# Altium schematic sheet MyCTRL_V2_Base_2.SchDoc
size A4; SheetNumber: 2; SheetTotal: 6
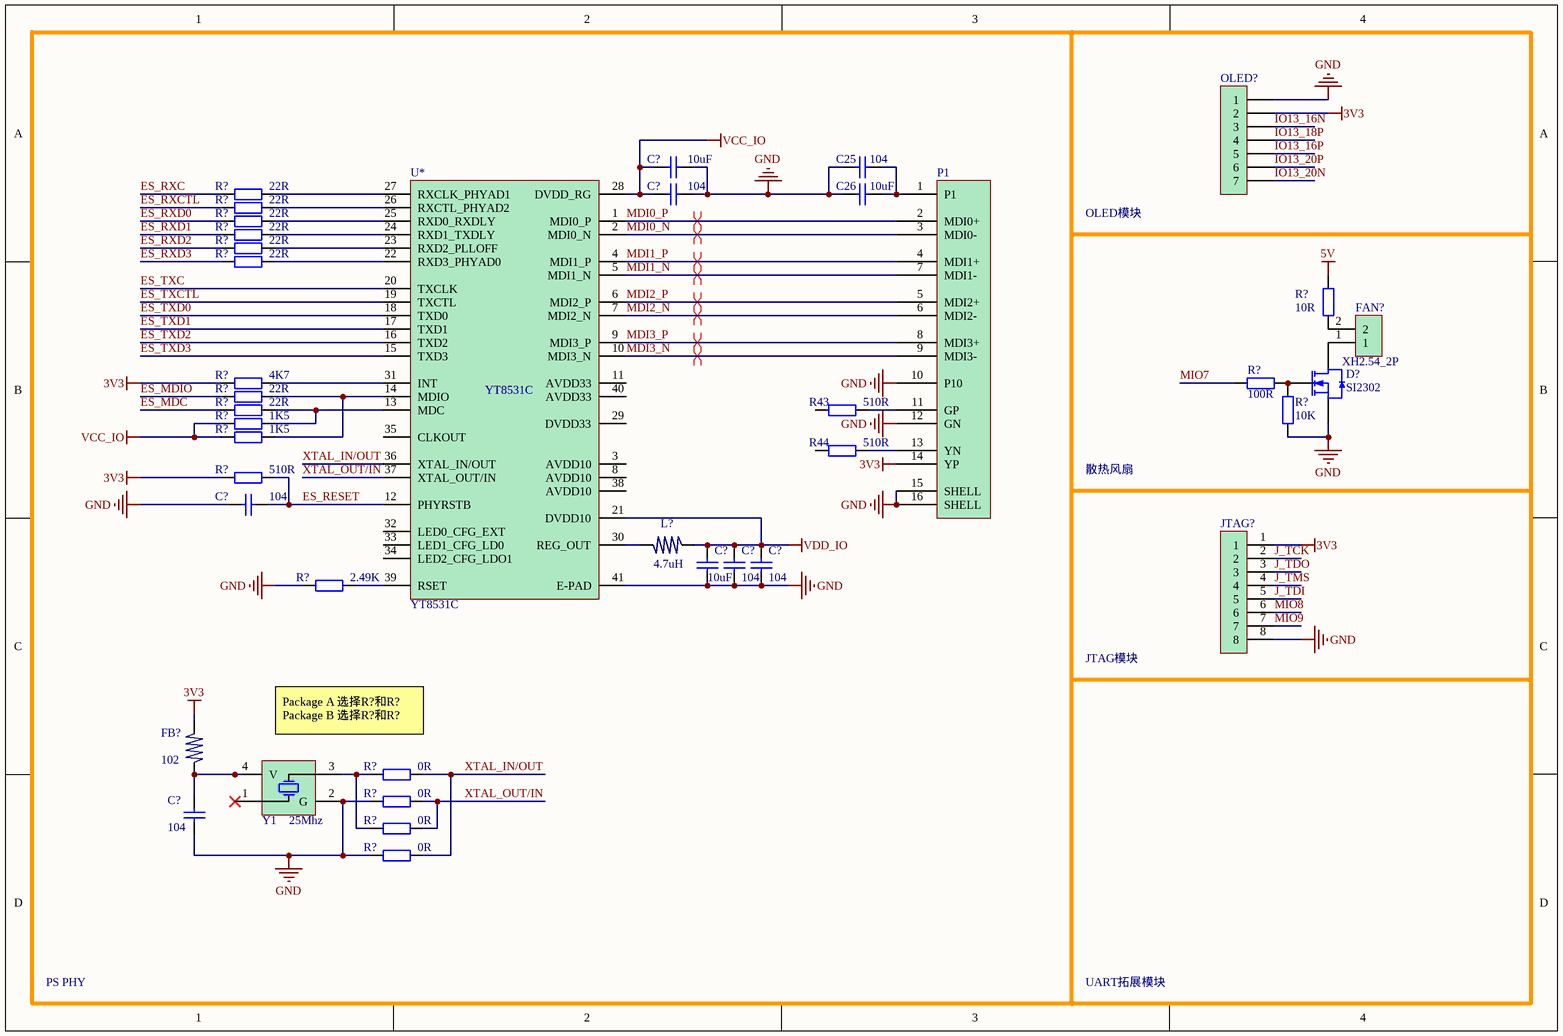
[diagram p0: MyCTRL_V2_Base_2.SchDoc]

## Parts
(Parts that share a designator on the sheet are numbered #1, #2 ... from top to bottom, then left to right.)
C25  104  [0402]
C26  10uF  [0402]
C?#1  10uF  [0402]
C?#2  104  [0402]
C?#3  104  [0402]
C?#4  10uF  [0402]
C?#5  104  [0402]
C?#6  104  [0402]
C?#7  104  [0402]
D?  SI2302  [SOT23]
FAN?  XH2.54_2P  [XH2.5_2P]
FB?  102  [0603]
JTAG?  SH1.25mm_8P  [SH1.25MM_8P]  (value not drawn)
L?  4.7uH  [0805]
OLED?  Header_2.54_7P  [HDR1_7P]  (value not drawn)
P1  RJ45  [HR911130A]  (value not drawn)
R43  510R  [R_0402]
R44  510R  [R_0402]
R?#1  22R  [R_0402]
R?#2  22R  [R_0402]
R?#3  22R  [R_0402]
R?#4  22R  [R_0402]
R?#5  22R  [R_0402]
R?#6  22R  [R_0402]
R?#7  10R  [R_0402]
R?#8  4K7  [R_0402]
R?#9  100R  [R_0402]
R?#10  10K  [R_0402]
R?#11  22R  [R_0402]
R?#12  22R  [R_0402]
R?#13  1K5  [R_0402]
R?#14  1K5  [R_0402]
R?#15  510R  [R_0402]
R?#16  2.49K  [R_0402]
R?#17  0R  [R_0402]
R?#18  0R  [R_0402]
R?#19  0R  [R_0402]
R?#20  0R  [R_0402]
U*  YT8531C
Y1  25Mhz  [XTAL_3225]

## Nets
3V3: FB?.1 JTAG?.1 OLED?.2 P1.14(YP) R?#8.1 R?#15.1
5V: R?#7.1
GND: C25.1 C26.1 C?#1.1 C?#2.2 C?#3.2 C?#4.1 C?#5.1 C?#6.1 C?#7.1 D?.2(S) JTAG?.8 OLED?.1 P1.10(P10) P1.12(GN) P1.15(SHELL) P1.16(SHELL) R?#10.2 R?#16.1 R?#18.1 R?#20.1 U*.41(E-PAD) Y1.2(G)
VCC_IO: C?#1.2 C?#2.1 R?#13.1 R?#14.1 U*.28(DVDD_RG)
VDD_IO: C?#4.2 C?#5.2 C?#6.2 L?.1 U*.21(DVDD10)
ES_MDC: R?#12.1
ES_MDIO: R?#11.1
ES_RESET: C?#3.1 R?#15.2 U*.12(PHYRSTB)
ES_RXC: R?#1.1
ES_RXCTL: R?#2.1
ES_RXD0: R?#3.1
ES_RXD1: R?#4.1
ES_RXD2: R?#5.1
ES_RXD3: R?#6.1
ES_TXC: U*.20(TXCLK)
ES_TXCTL: U*.19(TXCTL)
ES_TXD0: U*.18(TXD0)
ES_TXD1: U*.17(TXD1)
ES_TXD2: U*.16(TXD2)
ES_TXD3: U*.15(TXD3)
IO13_16N: OLED?.3
IO13_16P: OLED?.5
IO13_18P: OLED?.4
IO13_20N: OLED?.7
IO13_20P: OLED?.6
J_TCK: JTAG?.2
J_TDI: JTAG?.5
J_TDO: JTAG?.3
J_TMS: JTAG?.4
MDI0_N: P1.3(MDI0-) U*.2(MDI0_N)
MDI0_P: P1.2(MDI0+) U*.1(MDI0_P)
MDI1_N: P1.7(MDI1-) U*.5(MDI1_N)
MDI1_P: P1.4(MDI1+) U*.4(MDI1_P)
MDI2_N: P1.6(MDI2-) U*.7(MDI2_N)
MDI2_P: P1.5(MDI2+) U*.6(MDI2_P)
MDI3_N: P1.9(MDI3-) U*.10(MDI3_N)
MDI3_P: P1.8(MDI3+) U*.9(MDI3_P)
MIO7: R?#9.1
MIO8: JTAG?.6
MIO9: JTAG?.7
XTAL_IN/OUT: R?#17.2 R?#20.2 U*.36(XTAL_IN/OUT)
XTAL_OUT/IN: R?#18.2 R?#19.2 U*.37(XTAL_OUT/IN)
NetC25_2: C25.2 C26.2 P1.1(P1)
NetC?#7_2: C?#7.2 FB?.2 Y1.4(V)
NetD?_1: D?.1(G) R?#9.2 R?#10.1
NetD?_3: D?.3(D) FAN?.1
NetFAN?_2: FAN?.2 R?#7.2
NetL?_2: L?.2 U*.30(REG_OUT)
NetP1_11: P1.11(GP) R43.2
NetP1_13: P1.13(YN) R44.2
NetR?#1_2: R?#1.2 U*.27(RXCLK_PHYAD1)
NetR?#2_2: R?#2.2 U*.26(RXCTL_PHYAD2)
NetR?#3_2: R?#3.2 U*.25(RXD0_RXDLY)
NetR?#4_2: R?#4.2 U*.24(RXD1_TXDLY)
NetR?#5_2: R?#5.2 U*.23(RXD2_PLLOFF)
NetR?#6_2: R?#6.2 U*.22(RXD3_PHYAD0)
NetR?#8_2: R?#8.2 U*.31(INT)
NetR?#11_2: R?#11.2 R?#14.2 U*.14(MDIO)
NetR?#12_2: R?#12.2 R?#13.2 U*.13(MDC)
NetR?#16_2: R?#16.2 U*.39(RSET)
NetR?#17_1: R?#17.1 R?#19.1 Y1.3(OP)

Not connected (* = marked no-connect by the designer): R43 1; R44 1; U* 3(AVDD10) 8(AVDD10) 11(AVDD33) 29(DVDD33) 32(LED0_CFG_EXT) 33(LED1_CFG_LD0) 34(LED2_CFG_LDO1) 35(CLKOUT) 38(AVDD10) 40(AVDD33); Y1 1(EC)*

## Layout directives
differential pair: MDI0_N, MDI0_P, MDI1_N, MDI1_P, MDI2_N, MDI2_P, MDI3_N, MDI3_P

## Notes on the sheet
- OLED模块
- 散热风扇
- JTAG模块
- Package A 选择R?和R?
  Package B 选择R?和R?
- PS PHY
- UART拓展模块

## Library data of the parts
C25 C26 C?#1-C?#7 = CAP_0402: 贴片电容 0402
D? = MOSN_SI2302_SOT23: NMOS
FB? = FB_0603: 磁珠 0603
L? = L_0805: 电感 0805
P1 = RJ45_HR911130A
R43 R44 R?#1-R?#20 = RES_0402: 电阻 0402
U* = YT8531C: ETH1 10/100/1000M
Y1 = XTAL_3225: 贴片有源晶振